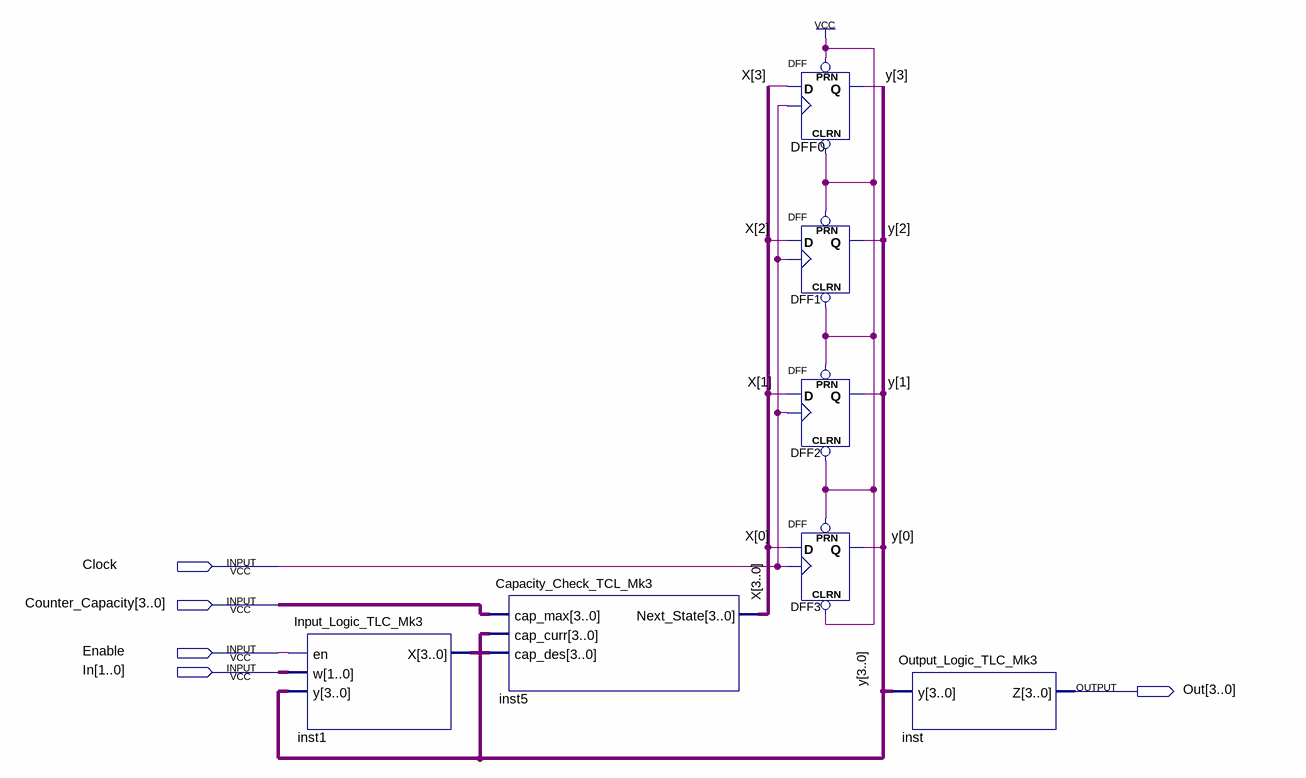
[diagram p0: schematic sheet]
// Quartus schematic TLC_Mk3.bdf as structural Verilog: 7 symbols, 5 pins
module TLC_Mk3 (
  input  Clock,
  input  [3:0] Counter_Capacity,
  input  Enable,
  input  [1:0] In,
  output [3:0] Out
);

  wire [3:0] inst1_x, X, y;

  Input_Logic_TLC_Mk3 inst1 (.en(Enable), .w(In), .y(y), .X(inst1_x));
  Capacity_Check_TCL_Mk3 inst5 (.cap_max(Counter_Capacity), .cap_curr(y), .cap_des(inst1_x), .Next_State(X));
  DFF DFF0 (.CLRN(1'b1), .CLK(Clock), .D(X[3]), .PRN(1'b1), .Q(y[3]));
  DFF DFF1 (.CLRN(1'b1), .CLK(Clock), .D(X[2]), .PRN(1'b1), .Q(y[2]));
  DFF DFF2 (.CLRN(1'b1), .CLK(Clock), .D(X[1]), .PRN(1'b1), .Q(y[1]));
  DFF DFF3 (.CLRN(1'b1), .CLK(Clock), .D(X[0]), .PRN(1'b1), .Q(y[0]));
  Output_Logic_TLC_Mk3 inst (.y(y), .Z(Out));
endmodule
